# EAGLE design Octal Transceiver Breakout (EAGLE 9.4.2)
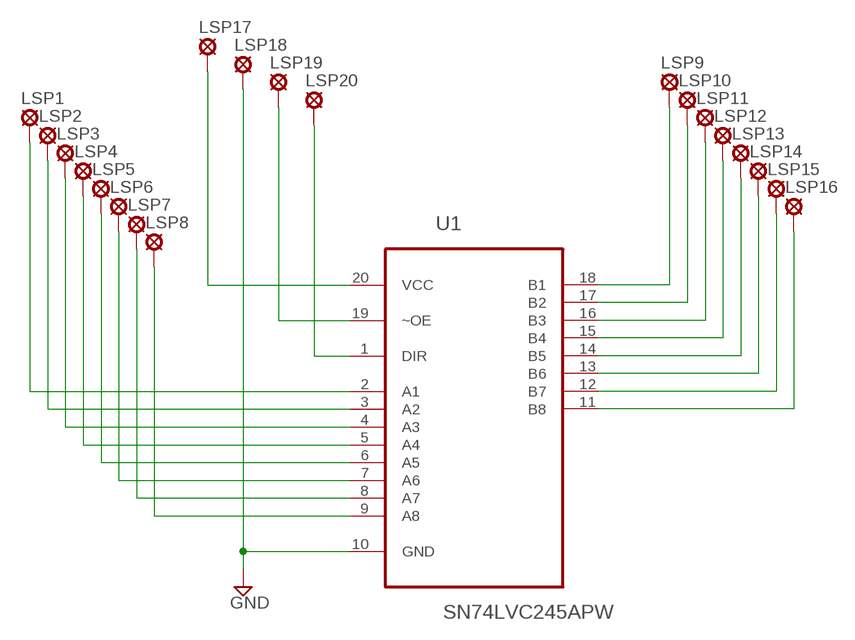
[diagram p0: schematic, sheet 1]

## Parts
LSP1  LSP10_CLSP10_C  [LSP10_C]
LSP2  LSP10_CLSP10_C  [LSP10_C]
LSP3  LSP10_CLSP10_C  [LSP10_C]
LSP4  LSP10_CLSP10_C  [LSP10_C]
LSP5  LSP10_CLSP10_C  [LSP10_C]
LSP6  LSP10_CLSP10_C  [LSP10_C]
LSP7  LSP10_CLSP10_C  [LSP10_C]
LSP8  LSP10_CLSP10_C  [LSP10_C]
LSP9  LSP10_CLSP10_C  [LSP10_C]
LSP10  LSP10_CLSP10_C  [LSP10_C]
LSP11  LSP10_CLSP10_C  [LSP10_C]
LSP12  LSP10_CLSP10_C  [LSP10_C]
LSP13  LSP10_CLSP10_C  [LSP10_C]
LSP14  LSP10_CLSP10_C  [LSP10_C]
LSP15  LSP10_CLSP10_C  [LSP10_C]
LSP16  LSP10_CLSP10_C  [LSP10_C]
LSP17  LSP10_CLSP10_C  [LSP10_C]
LSP18  LSP10_CLSP10_C  [LSP10_C]
LSP19  LSP10_CLSP10_C  [LSP10_C]
LSP20  LSP10_CLSP10_C  [LSP10_C]
U1  SN74LVC245APW  [SOP65P640X120-20N]

## Nets
GND: LSP18.P$1(MP) U1.10(GND)
N$1: LSP1.P$1(MP) U1.2(A1)
N$2: LSP2.P$1(MP) U1.3(A2)
N$3: LSP3.P$1(MP) U1.4(A3)
N$4: LSP4.P$1(MP) U1.5(A4)
N$5: LSP5.P$1(MP) U1.6(A5)
N$6: LSP6.P$1(MP) U1.7(A6)
N$7: LSP7.P$1(MP) U1.8(A7)
N$8: LSP8.P$1(MP) U1.9(A8)
N$9: LSP9.P$1(MP) U1.18(B1)
N$10: LSP10.P$1(MP) U1.17(B2)
N$11: LSP11.P$1(MP) U1.16(B3)
N$12: LSP12.P$1(MP) U1.15(B4)
N$13: LSP13.P$1(MP) U1.14(B5)
N$14: LSP14.P$1(MP) U1.13(B6)
N$15: LSP15.P$1(MP) U1.12(B7)
N$16: LSP16.P$1(MP) U1.11(B8)
N$17: LSP17.P$1(MP) U1.20(VCC)
N$19: LSP19.P$1(MP) U1.19(~OE)
N$20: LSP20.P$1(MP) U1.1(DIR)

## Library data of the parts
LSP1-LSP20 = tbtaco-solpad:LSP10_C: SOLDER PAD drill 1.0 mm, distributor Buerklin, 12H555
U1 = SN74LVC245APW:SN74LVC245APW: OCTAL BUS TRANSCEIVER WITH 3-STATE OUTPUTS; AVAILABILITY: Unavailable; DESCRIPTION: Octal Bus Transceiver With 3-State Outputs 20-TSSOP -40 to 125; MF: Texas Instruments; MP: SN74LVC245APW; PACKAGE: TSSOP-20 Texas Instruments; PRICE: None

## Board
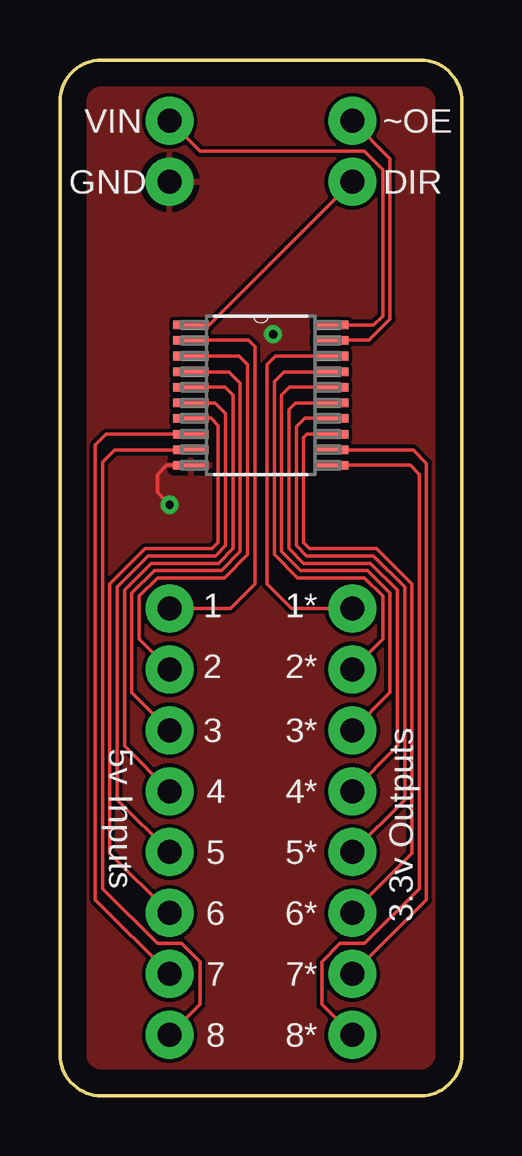
[diagram p1: board, top side]
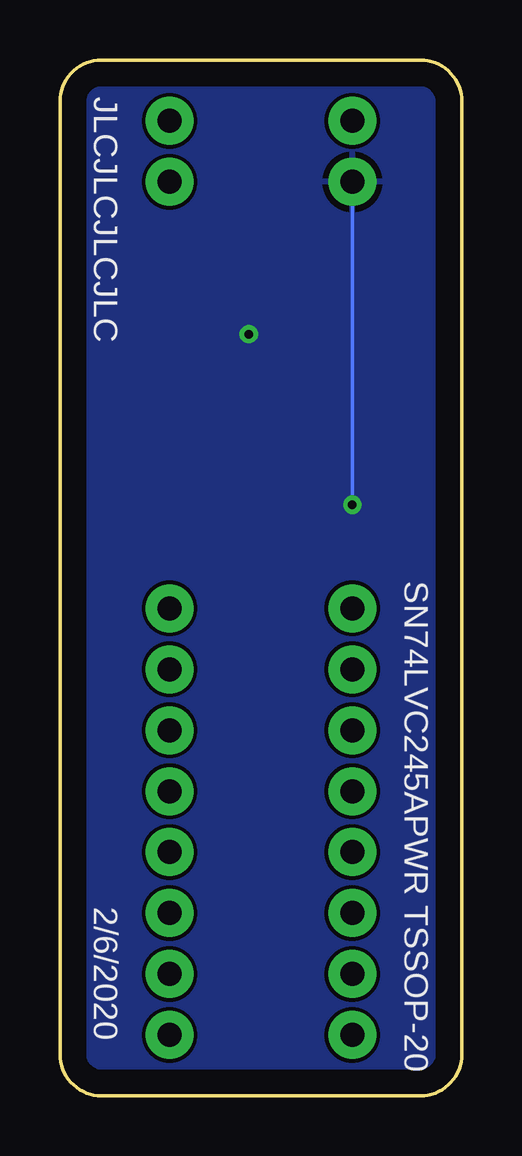
[diagram p2: board, bottom side, seen from below]

Size 16.76 x 43.18 mm. Coordinates in mm from the lower left corner, seen from the top.
Outline: 15.03,0 1.73,0 arc-90 0,1.73 0,41.45 arc-90 1.73,43.18 15.03,43.18 arc-90 16.76,41.45 16.76,1.73 arc-90 15.03,0
Copper layers (1*16): Top 0.035mm / dielectric 1.5mm / Bottom 0.035mm
Design rules "default": minimum track width 6mil, minimum drill 0.35mm, track to track 6mil, track to pad 6mil, pad to pad 6mil, via to via 6mil, smd to smd 6mil, copper to edge 40mil, drill to drill 6mil, minimum pad ring 10mil, minimum via ring 8mil, stop-mask expansion 4mil, vias tented up to drill 0mil, thermal gap 10mil

### Footprints (pad centres in the part's own frame; a part is rotated, then mirrored left to right if it is on the bottom)
LSP10_C = drill 1 pad 2: P$1 0,0
SOP65P640X120-20N = smd 1.473 x 0.356: 1 -2.921,2.921; 2 -2.921,2.286; 3 -2.921,1.626; 4 -2.921,0.965; 5 -2.921,0.33; 6 -2.921,-0.33; 7 -2.921,-0.965; 8 -2.921,-1.626; 9 -2.921,-2.286; 10 -2.921,-2.921; 11 2.921,-2.921; 12 2.921,-2.286; 13 2.921,-1.626; 14 2.921,-0.965; 15 2.921,-0.33; 16 2.921,0.33; 17 2.921,0.965; 18 2.921,1.626; 19 2.921,2.286; 20 2.921,2.921

### Placement (x,y rotation side)
LSP1  4.57,20.32 0 top
LSP2  4.57,17.78 0 top
LSP3  4.57,15.24 0 top
LSP4  4.57,12.7 0 top
LSP5  4.57,10.16 0 top
LSP6  4.57,7.62 0 top
LSP7  4.57,5.08 0 top
LSP8  4.57,2.54 0 top
LSP9  12.19,20.32 0 top
LSP10  12.19,17.78 0 top
LSP11  12.19,15.24 0 top
LSP12  12.19,12.7 0 top
LSP13  12.19,10.16 0 top
LSP14  12.19,7.62 0 top
LSP15  12.19,5.08 0 top
LSP16  12.19,2.54 0 top
LSP17  4.57,40.64 0 top
LSP18  4.57,38.1 0 top
LSP19  12.19,40.64 0 top
LSP20  12.19,38.1 0 top
U1  8.38,29.21 0 top

### Tracks (layer width: path | path; a pad name or v marks a point on that pad's centre or on a via)
GND  (via drill 0.35)
  Top 0.152: U1.10 4.45,26.29 4.06,25.91 4.06,25.15 v4.57,24.64
  Bottom 0.152: v4.57,24.64 LSP18.P$1
  other vias: 8.89,31.75
  pour Top: 0,43.18 16.76,43.18 16.76,0 0,0 0,6.86
  pour Bottom: 0,43.18 16.76,43.18 16.76,0 0,0
N$1
  Top 0.152: LSP1.P$1 7.11,20.32 8.13,21.34 8.13,31.24 7.87,31.5 U1.2
N$2
  Top 0.152: LSP2.P$1 3.3,19.05 3.3,20.83 4.06,21.59 6.86,21.59 7.82,22.56 7.82,30.48 7.47,30.84 U1.3
N$3
  Top 0.152: LSP3.P$1 3,16.82 3,20.95 3.94,21.89 6.73,21.89 7.52,22.68 7.52,29.72 7.06,30.18 U1.4
N$4
  Top 0.152: LSP4.P$1 2.69,14.58 2.69,21.08 3.81,22.2 6.61,22.2 7.21,22.81 7.21,29.21 6.88,29.54 U1.5
N$5
  Top 0.152: LSP5.P$1 2.39,12.34 2.39,21.21 3.69,22.5 6.48,22.5 6.91,22.93 6.91,28.45 6.48,28.88 U1.6
N$6
  Top 0.152: LSP6.P$1 2.08,10.11 2.08,21.33 3.56,22.81 6.35,22.81 6.6,23.06 6.6,27.94 6.3,28.25 U1.7
N$7
  Top 0.152: LSP7.P$1 1.47,8.18 1.47,27.13 1.93,27.58 U1.8
N$8
  Top 0.152: LSP8.P$1 5.84,3.81 5.84,5.59 5.08,6.35 4.06,6.35 1.78,8.64 1.78,26.42 2.29,26.92 U1.9
N$9
  Top 0.152: LSP9.P$1 9.65,20.32 8.64,21.34 8.64,30.48 8.99,30.84 U1.18
N$10
  Top 0.152: LSP10.P$1 13.46,19.05 13.46,20.83 12.7,21.59 9.91,21.59 8.94,22.56 8.94,29.77 9.35,30.18 U1.17
N$11
  Top 0.152: LSP11.P$1 13.77,16.82 13.77,20.95 12.83,21.89 10.03,21.89 9.25,22.68 9.25,29.21 9.58,29.54 U1.16
N$12
  Top 0.152: LSP12.P$1 14.07,14.58 14.07,21.08 12.95,22.2 10.16,22.2 9.55,22.81 9.55,28.6 9.83,28.88 U1.15
N$13
  Top 0.152: LSP13.P$1 14.38,12.34 14.38,21.21 13.08,22.5 10.29,22.5 9.86,22.93 9.86,27.89 10.21,28.25 U1.14
N$14
  Top 0.152: LSP14.P$1 14.68,10.11 14.68,21.33 13.2,22.81 10.41,22.81 10.16,23.06 10.16,27.43 10.31,27.58 U1.13
N$15
  Top 0.152: LSP15.P$1 15.29,8.18 15.29,26.36 14.73,26.92 U1.12
N$16
  Top 0.152: LSP16.P$1 10.92,3.81 10.92,5.59 11.68,6.35 12.7,6.35 14.99,8.64 14.99,25.91 14.61,26.29 U1.11
N$17
  Top 0.152: LSP17.P$1 5.84,39.37 12.7,39.37 13.46,38.61 13.46,32.51 13.08,32.13 U1.20
N$19
  Top 0.152: U1.19 12.88,31.5 13.77,32.39 13.77,39.06 LSP19.P$1
N$20
  Top 0.152: LSP20.P$1 6.22,32.13 U1.1

### Text on the board
tPlace: VIN | ~OE | GND | DIR | 1 | 1* | 2 | 2* | 5v Inputs | 3 | 3* | 4 | 4* | 5 | 5* | 6 | 6* | 3.3v Outputs | 7 | 7* | 8 | 8*
bPlace: JLCJLCJLCJLC | SN74LVC245APWR TSSOP-20 | 2/6/2020